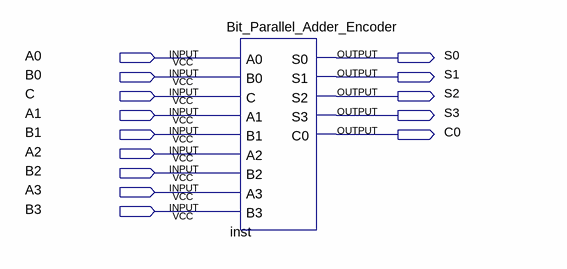
[diagram p0: schematic sheet]
// Quartus schematic Bit_Parallel_Adder.bdf as structural Verilog: 1 symbols, 14 pins
module Bit_Parallel_Adder (
  input  A0,
  input  B0,
  input  C,
  input  A1,
  input  B1,
  input  A2,
  input  B2,
  input  A3,
  input  B3,
  output S0,
  output S1,
  output S2,
  output S3,
  output C0
);

  Bit_Parallel_Adder_Encoder inst (
    .A0(A0), .B0(B0), .C(C), .A1(A1), .B1(B1), .A2(A2), .B2(B2), .A3(A3), .B3(B3), .S0(S0), .S1(S1), .S2(S2),
    .S3(S3), .C0(C0));
endmodule
